# Altium schematic sheet Sheet1.SchDoc
size 209 x 297 mm; Scale: 1:1; DocumentType: ����� ������������� ��������������; FirstReferrence: ����.123456.001
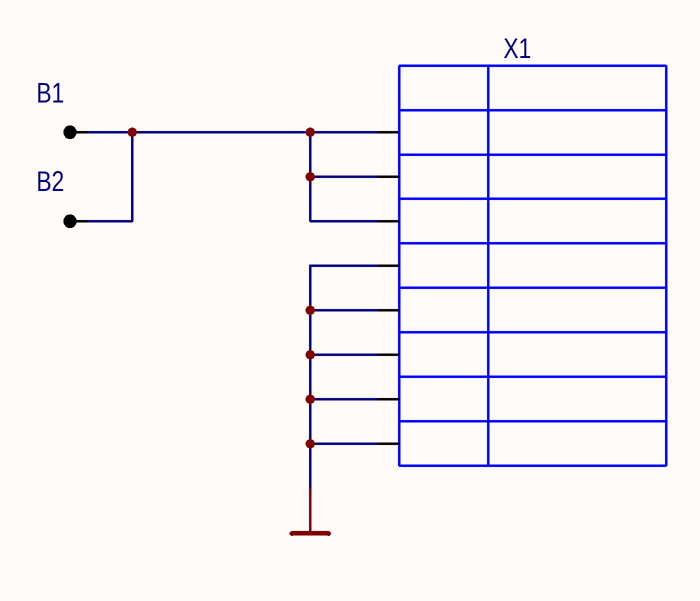
[diagram p0: Sheet1.SchDoc]

## Parts
B1  Pin_1  [18650pad]  (value not drawn)
B2  Pin_1  [18650pad]  (value not drawn)
X1  PLS8  [FFC-SMD_6P-P0.50_FFC05001-06SBA124W5M]  (value not drawn)

## Nets
GND: X1.4 X1.5 X1.6 X1.7 X1.8
NetB1_1: B1.1 B2.1 X1.1 X1.2 X1.3

## Notes on the sheet
- ����. ������.
- �����. �
- ����. � ����
- ���. � ����.
- ����. ���. �
- ������.
- ���.
- ����
- � �����.
- ����.
- �����
- �������
- �.�����.
- ������
- 2.106-A4
- ���������
- ������ �4

## Library data of the parts
X1 = PLS8: Manufacturer: ф. Ningbo Zhenqin Electronic; BCDId: *; ManufacturerPartNumber: PLS8; TU/GOST: *; Type: Разъём; ValueBOM: *